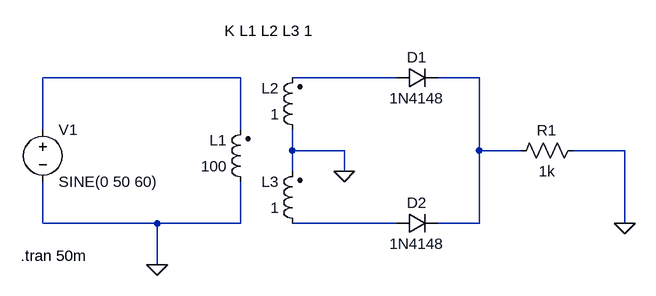
[diagram p0: schematic Full_Wave_1N4148.asc]
Full_Wave_1N4148.asc, the LTspice schematic file:
Version 4
SHEET 1 880 680
WIRE 144 48 -160 48
WIRE 384 48 224 48
WIRE 512 48 448 48
WIRE -160 128 -160 48
WIRE 144 128 144 48
WIRE 224 160 224 128
WIRE 304 160 224 160
WIRE 512 160 512 48
WIRE 576 160 512 160
WIRE 736 160 656 160
WIRE 224 192 224 160
WIRE 304 192 304 160
WIRE -160 272 -160 208
WIRE 16 272 -160 272
WIRE 144 272 144 208
WIRE 144 272 16 272
WIRE 384 272 224 272
WIRE 512 272 512 160
WIRE 512 272 448 272
WIRE 736 272 736 160
WIRE 16 336 16 272
FLAG 16 336 0
FLAG 736 272 0
FLAG 304 192 0
SYMBOL ind2 160 224 R180
WINDOW 0 36 80 Left 2
WINDOW 3 36 40 Left 2
SYMATTR InstName L1
SYMATTR Value 100
SYMATTR Type ind
SYMATTR SpiceLine Rser=1
SYMBOL ind2 240 144 R180
WINDOW 0 36 80 Left 2
WINDOW 3 36 40 Left 2
SYMATTR InstName L2
SYMATTR Value 1
SYMATTR Type ind
SYMBOL ind2 240 288 R180
WINDOW 0 36 80 Left 2
WINDOW 3 36 40 Left 2
SYMATTR InstName L3
SYMATTR Value 1
SYMATTR Type ind
SYMBOL diode 384 64 R270
WINDOW 0 32 32 VTop 2
WINDOW 3 0 32 VBottom 2
SYMATTR InstName D1
SYMATTR Value 1N4148
SYMBOL diode 384 288 R270
WINDOW 0 32 32 VTop 2
WINDOW 3 0 32 VBottom 2
SYMATTR InstName D2
SYMATTR Value 1N4148
SYMBOL voltage -160 112 R0
WINDOW 123 0 0 Left 0
WINDOW 39 0 0 Left 0
SYMATTR InstName V1
SYMATTR Value SINE(0 50 60)
SYMBOL res 672 144 R90
WINDOW 0 0 56 VBottom 2
WINDOW 3 32 56 VTop 2
SYMATTR InstName R1
SYMATTR Value 1k
TEXT -194 322 Left 2 !.tran 50m
TEXT 120 -24 Left 2 !K L1 L2 L3 1

The netlist it stands for:
* Full_Wave_1N4148.asc
L1 0 N001 100 Rser=1
L2 0 N002 1
L3 N004 0 1
D1 N002 N003 1N4148
D2 N004 N003 1N4148
V1 N001 0 SINE(0 50 60)
R1 0 N003 1k
.model D D
.lib standard.dio
.tran 50m
K L1 L2 L3 1
.backanno
.end